# Altium schematic sheet 555(mono).SchDoc
size A
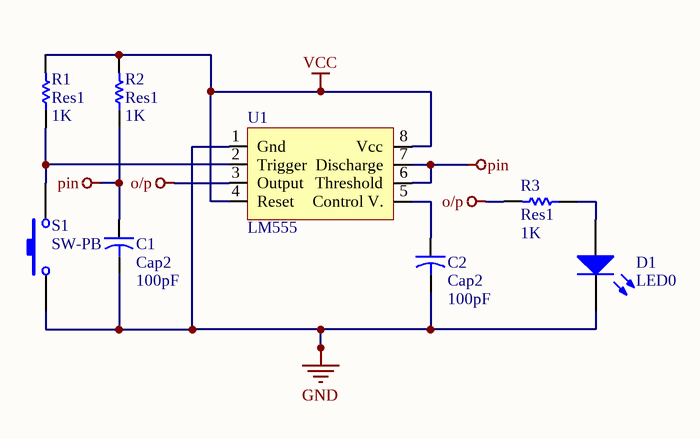
[diagram p0: 555(mono).SchDoc]

## Parts
C1  Cap2  value 100pF  [CAPR5-4X5]
C2  Cap2  value 100pF  [CAPR5-4X5]
D1  LED0  [LED-0]
R1  Res1  value 1K  [AXIAL-0.3]
R2  Res1  value 1K  [AXIAL-0.3]
R3  Res1  value 1K  [AXIAL-0.3]
S1  SW-PB  [SPST-2]
U1  LM555  [LM555]

## Nets
GND: C1.2 C2.2 D1.2(K) S1.1 U1.1(Gnd)
o/p: R3.2 U1.3(Output)
pin: C1.1 R2.1 U1.6(Threshold) U1.7(Discharge)
VCC: R1.2 R2.2 U1.4(Reset) U1.8(Vcc)
NetC2_1: C2.1 U1.5(Control_V.)
NetD1_1: D1.1(A) R3.1
NetR1_1: R1.1 S1.2 U1.2(Trigger)

## Library data of the parts
C1 C2 = Cap2: Capacitor; Published: 23-Sep-2002; PackageReference: CAPR5-4X5; Publisher: Altium Limited; PackageDescription: Capacitor; 2 Leads
D1 = LED0: Typical INFRARED GaAs LED; Published: 8-Jun-2000; LatestRevisionDate: 08-Jul-2005; LatestRevisionNote: Mech Layer 1 removed.; PackageReference: LED-0; Publisher: Altium Limited; PackageDescription: LED; 2 Leads
R1-R3 = Res1: Resistor; Published: 8-Jun-2000; LatestRevisionDate: 17-Jul-2002; LatestRevisionNote: Re-released for DXP Platform.; PackageReference: AXIAL-0.3; Publisher: Altium Limited; PackageDescription: Axial Device, Thru-Hole; 2 Leads; 0.3 in Pin Spacing
S1 = SW-PB: Switch; Published: 24-Mar-1999; LatestRevisionDate: 17-Jul-2002; LatestRevisionNote: Re-released for DXP Platform.; PackageReference: SPST-2; Publisher: Altium Limited; PackageDescription: Switch; 2 Leads